# Altium project PCB_Project.PrjPcb
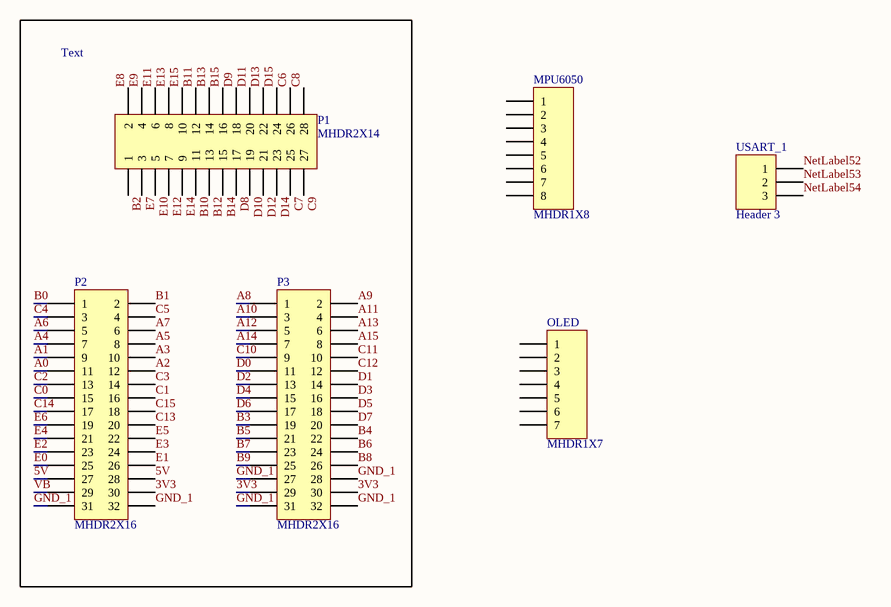
[diagram p0: Sheet1.SchDoc]
1 sheet, 6 parts. Net scope: global (net labels, ports and power ports of the same name join across sheets).
Board file: PCB1.PcbDoc

## Sheet Sheet1.SchDoc
size A4

### Parts
MPU6050  MHDR1X8  [MHDR1X8]
OLED  MHDR1X7  [MHDR1X7]
P1  MHDR2X14  [MHDR2X14]
P2  MHDR2X16  [MHDR2X16]
P3  MHDR2X16  [MHDR2X16]
USART_1  Header 3  [HDR1X3]

### Blocks framed on the sheet
Text: P1-P3

### Nets
3V3: P2.30 P3.29 P3.30
5V: P2.27 P2.28
A0: P2.11
A1: P2.9
A2: P2.12
A3: P2.10
A4: P2.7
A5: P2.8
A6: P2.5
A7: P2.6
A8: P3.1
A9: P3.2
A10: P3.3
A11: P3.4
A12: P3.5
A13: P3.6
A14: P3.7
A15: P3.8
B0: P2.1
B1: P2.2
B2: P1.1
B3: P3.19
B4: P3.22
B5: P3.21
B6: P3.24
B7: P3.23
B8: P3.26
B9: P3.25
B10: P1.11
B11: P1.12
B12: P1.13
B13: P1.14
B14: P1.15
B15: P1.16
C0: P2.15
C1: P2.16
C2: P2.13
C3: P2.14
C4: P2.3
C5: P2.4
C6: P1.26
C7: P1.25
C8: P1.28
C9: P1.27
C10: P3.9
C11: P3.10
C12: P3.12
C13: P2.20
C14: P2.17
C15: P2.18
D0: P3.11
D1: P3.14
D2: P3.13
D3: P3.16
D4: P3.15
D5: P3.18
D6: P3.17
D7: P3.20
D8: P1.17
D9: P1.18
D10: P1.19
D11: P1.20
D12: P1.21
D13: P1.22
D14: P1.23
D15: P1.24
E0: P2.25
E1: P2.26
E2: P2.23
E3: P2.24
E4: P2.21
E5: P2.22
E6: P2.19
E7: P1.3
E8: P1.2
E9: P1.4
E10: P1.5
E11: P1.6
E12: P1.7
E13: P1.8
E14: P1.9
E15: P1.10
GND_1: P2.31 P2.32 P3.27 P3.28 P3.31 P3.32
NetLabel52: USART_1.1
NetLabel53: USART_1.2
NetLabel54: USART_1.3
VB: P2.29

Not connected (* = marked no-connect by the designer): MPU6050 1 2 3 4 5 6 7 8; OLED 1 2 3 4 5 6 7

### Library data of the parts
MPU6050 = MHDR1X8: Header, 8-Pin; LatestRevisionDate: 17-Jul-2002; LatestRevisionNote: Re-released for DXP Platform.; Publisher: Altium Limited
OLED = MHDR1X7: Header, 7-Pin; LatestRevisionDate: 17-Jul-2002; LatestRevisionNote: Re-released for DXP Platform.; Publisher: Altium Limited
P1 = MHDR2X14: Header, 14-Pin, Dual row; LatestRevisionDate: 17-Jul-2002; LatestRevisionNote: Re-released for DXP Platform.; Publisher: Altium Limited
P2 P3 = MHDR2X16: Header, 16-Pin, Dual row; LatestRevisionDate: 17-Jul-2002; LatestRevisionNote: Re-released for DXP Platform.; Publisher: Altium Limited
USART_1 = Header 3: Header, 3-Pin; LatestRevisionDate: 17-Jul-2002; LatestRevisionNote: Re-released for DXP Platform.; Publisher: Altium Limited